# Altium schematic sheet Mechanical.SchDoc
size A4; DrawnBy: Marin Sinožić; SheetNumber: 6; SheetTotal: 6
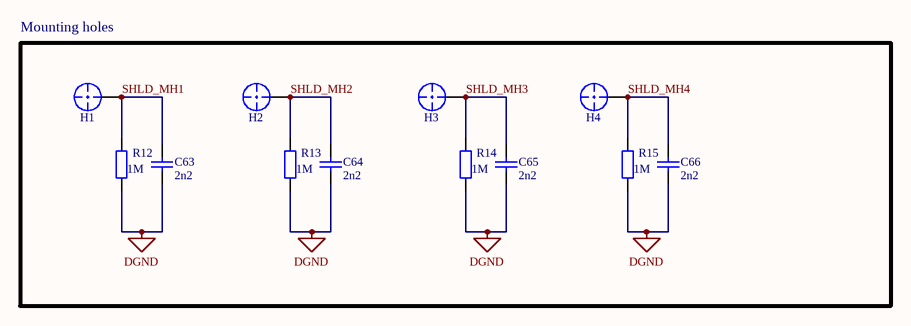
[diagram p0: Mechanical.SchDoc]

## Parts
C63  2n2  [0603]
C64  2n2  [0603]
C65  2n2  [0603]
C66  2n2  [0603]
H1  Hole_Mount  [HoleMount]  (value not drawn)
H2  Hole_Mount  [HoleMount]  (value not drawn)
H3  Hole_Mount  [HoleMount]  (value not drawn)
H4  Hole_Mount  [HoleMount]  (value not drawn)
R12  1M  [0603]
R13  1M  [0603]
R14  1M  [0603]
R15  1M  [0603]

## Blocks framed on the sheet
Mounting holes: C63-C66 H1-H4 R12-R15

## Nets
DGND: C63.1 C64.1 C65.1 C66.1 R12.1 R13.1 R14.1 R15.1
SHLD_MH1: C63.2 H1.1(CONNECT_TO) R12.2
SHLD_MH2: C64.2 H2.1(CONNECT_TO) R13.2
SHLD_MH3: C65.2 H3.1(CONNECT_TO) R14.2
SHLD_MH4: C66.2 H4.1(CONNECT_TO) R15.2

## Notes on the sheet
- Project:
- Title:
- Size:
- A4
- DrawnBy:
- Date:
- Sheet
- of

## Library data of the parts
C63-C66 = Cap: CAP CER 39PF 50V C0G/NP0 0603; Manufacturer Part Number: 720-VJ0603A390GXACW1BCCT-ND; Value: 2n2; Supplier 1: Digi-Key; Price: 0.15
R12-R15 = Res2: RES 100 KOHMS 0.5% 1/10W 0603; Manufacturer Part Number: P123902CT-ND; Value: 1M; Supplier 1: Digi-Key; Price: 0.11